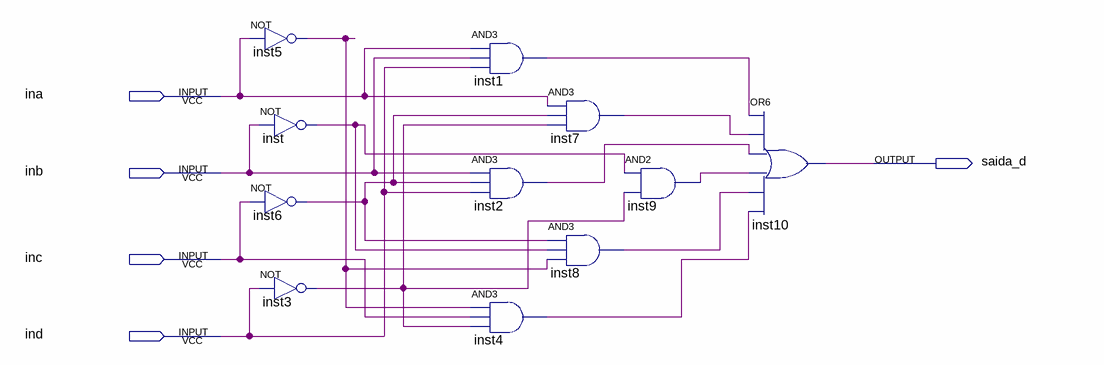
[diagram p0: schematic sheet]
// Quartus schematic d.bdf as structural Verilog: 11 symbols, 5 pins
module d (
  input  ina,
  input  inb,
  input  inc,
  input  ind,
  output saida_d
);

  wire inst1_out, inst2_out, inst3_out, inst4_out, inst5_out, inst6_out, inst7_out, inst8_out, inst9_out,
       inst_out;

  not inst5 (inst5_out, ina);
  not inst (inst_out, inb);
  not inst6 (inst6_out, inc);
  not inst3 (inst3_out, ind);
  and inst1 (inst1_out, ina, inb, ind);
  and inst2 (inst2_out, inb, inst6_out, ind);
  and inst4 (inst4_out, inst5_out, inc, inst3_out);
  and inst7 (inst7_out, ina, inst6_out, inst3_out);
  and inst8 (inst8_out, inst6_out, inst_out, inst5_out);
  and inst9 (inst9_out, inst_out, inst3_out);
  or inst10 (saida_d, inst1_out, inst7_out, inst2_out, inst9_out, inst8_out, inst4_out);
endmodule
